# EAGLE design untitled (EAGLE 9.3.0)
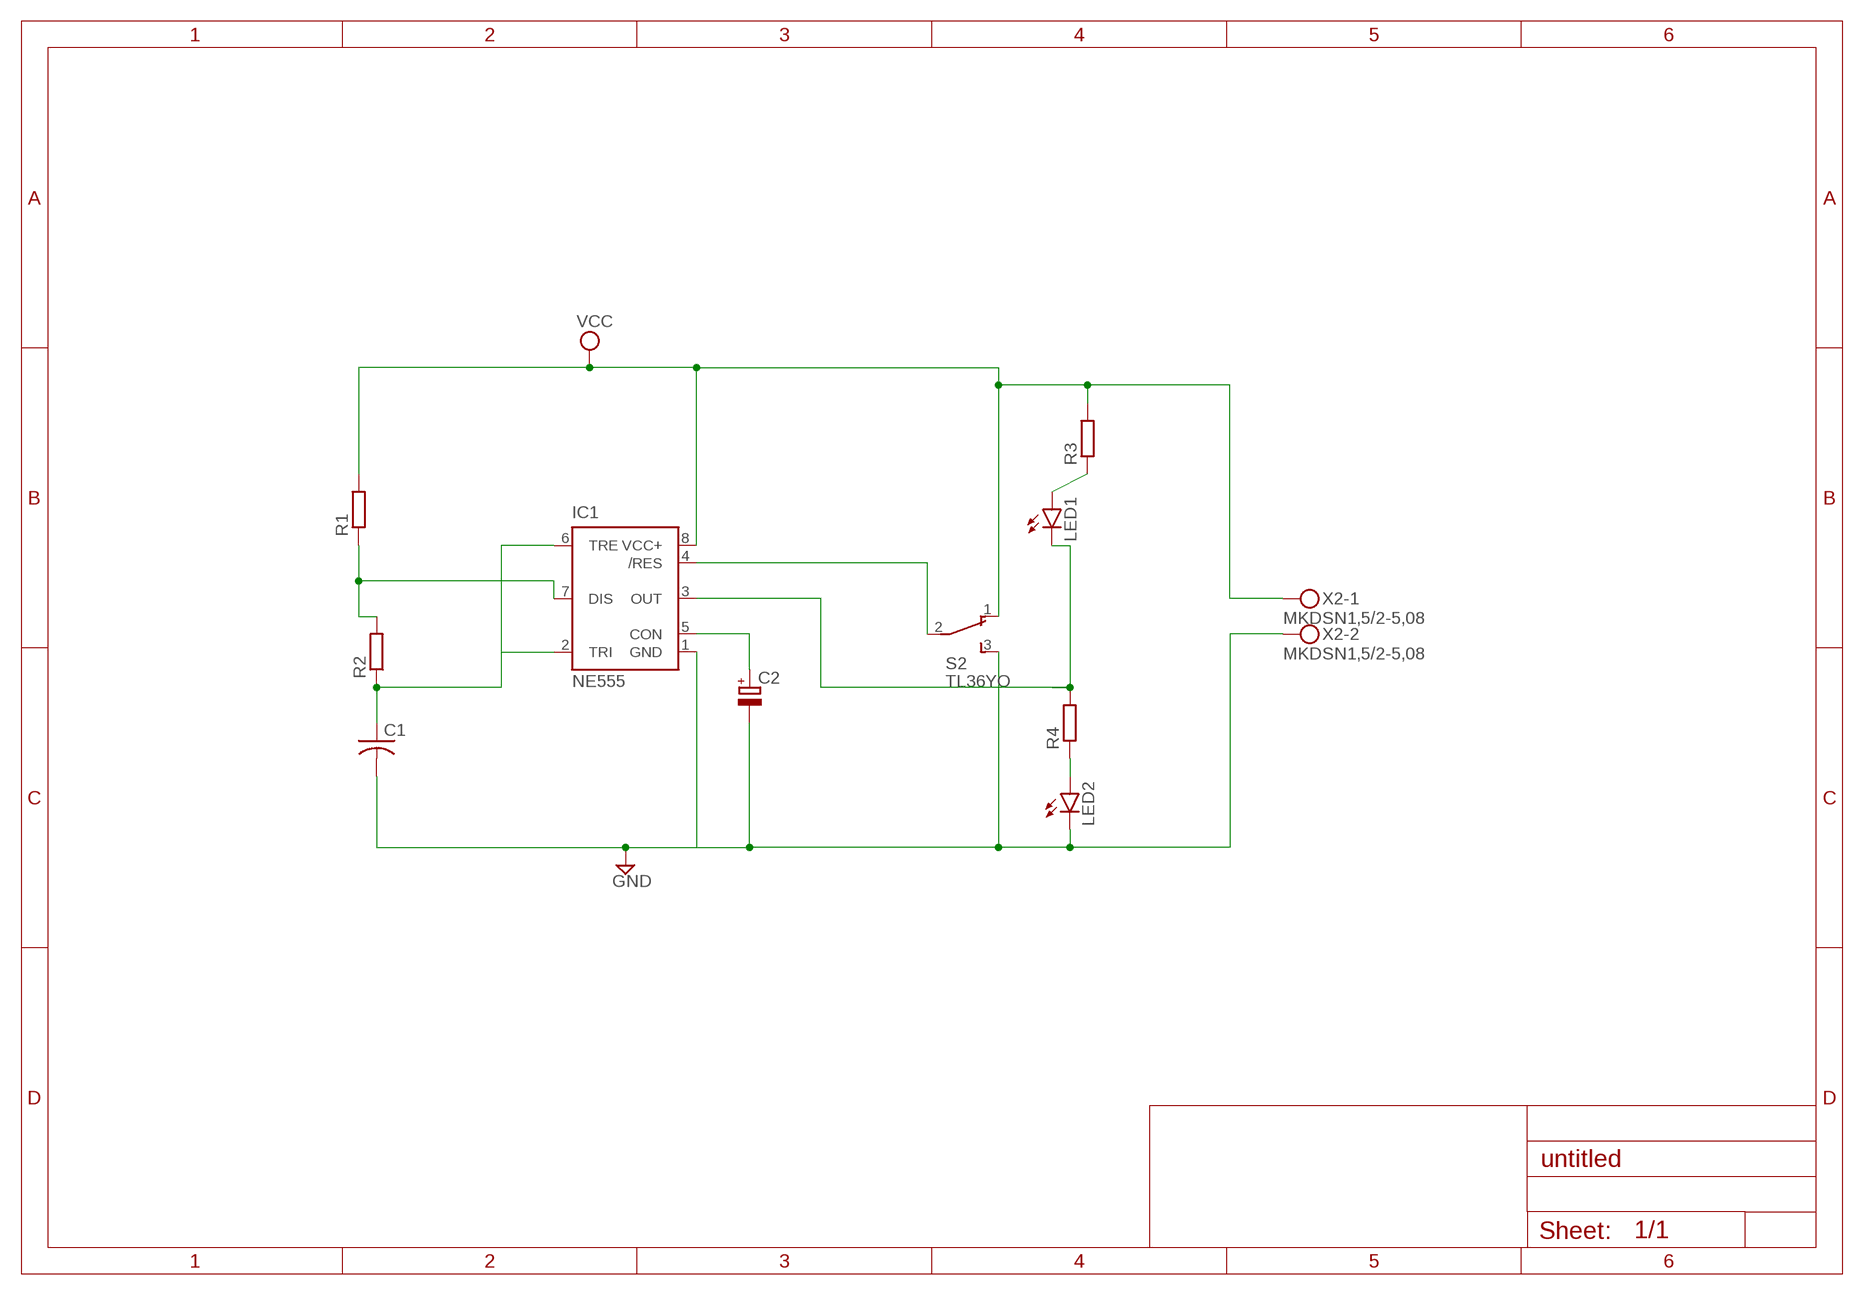
[diagram p0: schematic, sheet 1]

## Parts
C1  C-US025-025X050  [C025-025X050]
C2  CPOL-EUE3.5-8  [E3,5-8]
IC1  NE555  [DIL-08]
LED1  LED5MM  [LED5MM]
LED2  LED5MM  [LED5MM]
R1  R-EU_0309/12  [0309/12]
R2  R-EU_0309/12  [0309/12]
R3  R-EU_0309/12  [0309/12]
R4  R-EU_0309/12  [0309/12]
S2  TL36YO  [TL3XYO]
X2  MKDSN1,5/2-5,08  [MKDSN1,5/2-5,08]

## Nets
GND: C1.2 C2.- IC1.1(GND) LED2.K(C) S2.3(S) X2.2
N$1: IC1.7(DIS) R1.1 R2.2
N$2: C1.1 IC1.2(TRI) IC1.6(TRE) R2.1
N$3: C2.+ IC1.5(CON)
N$4: LED2.A R4.1
N$5: IC1.3(OUT) LED1.K(C) R4.2
N$6: IC1.4(/RES) S2.2(P)
N$7: LED1.A R3.1
VCC: IC1.8(VCC+) R1.2 R3.2 S2.1(O) X2.1

## Library data of the parts
C1 = rcl:C-US: CAPACITOR, American symbol; SPICEPREFIX: C
C2 = rcl:CPOL-EU: POLARIZED CAPACITOR, European symbol; SPICEPREFIX: C
IC1 = st-microelectronics:NE555: General purpose bipolar Timer; MF: Arrow Electronics; MPN: NE555N; OC_FARNELL: 1467742; OC_NEWARK: 89K1486
LED1 LED2 = led:LED: LED OSRAM: - CHIPLED LG R971, LG N971, LY N971, LG Q971, LY Q971, LO R971, LY R971 LH N974, LH R974 LS Q976, LO Q976, LY Q976 LO Q996 - Hyper CHIPLED LW Q18S LB Q993, LB Q99A, LB R99A - SideLED LS A670, LO A670, LY A670, LG A670, LP A670 LB A673, LV A673, LT A673, LW A673 LH A674 LY A675 LS A676, LA A676, LO A676, LY A676, LW A676 LS A679, LY A679, LG A679 - Hyper Micro SIDELED® LS Y876, LA Y876, LO Y876, LY Y876 LT Y87S - SmartLED LW L88C, LW L88S LB L89C, LB L89S, LG L890 LS L89K, LO L89K, LY L89K LS L896, LA L896, LO L896, LY L896 - TOPLED LS T670, LO T670, LY T670, LG T670, LP T670 LSG T670, LSP T670, LSY T670, LOP T670, LYG T670 LG T671, LOG T671, LSG T671 LB T673, LV T673, LT T673, LW T673 LH T674 LS T676, LA T676, LO T676, LY T676, LB T676, LH T676, LSB T676, LW T676 LB T67C, LV T67C, LT T67C, LS T67K, LO T67K, LY T67K, LW E67C LS E67B, LA E67B, LO E67B, LY E67B, LB E67C, LV E67C, LT E67C LW T67C LS T679, LY T679, LG T679 LS T770, LO T770, LY T770, LG T770, LP T770 LB T773, LV T773, LT T773, LW T773 LH T774 LS E675, LA E675, LY E675, LS T675 LS T776, LA T776, LO T776, LY T776, LB T776 LHGB T686 LT T68C, LB T68C - Hyper Mini TOPLED® LB M676 - Mini TOPLED Santana® LG M470 LS M47K, LO M47K, LY M47K Source: http://www.osram.convergy.de LUXEON: - LUMILED® LXK2-PW12-R00, LXK2-PW12-S00, LXK2-PW14-U00, LXK2-PW14-V00 LXK2-PM12-R00, LXK2-PM12-S00, LXK2-PM14-U00 LXK2-PE12-Q00, LXK2-PE12-R00, LXK2-PE12-S00, LXK2-PE14-T00, LXK2-PE14-U00 LXK2-PB12-K00, LXK2-PB12-L00, LXK2-PB12-M00, LXK2-PB14-N00, LXK2-PB14-P00, LXK2-PB14-Q00 LXK2-PR12-L00, LXK2-PR12-M00, LXK2-PR14-Q00, LXK2-PR14-R00 LXK2-PD12-Q00, LXK2-PD12-R00, LXK2-PD12-S00 LXK2-PH12-R00, LXK2-PH12-S00 LXK2-PL12-P00, LXK2-PL12-Q00, LXK2-PL12-R00 Source: www.luxeon.com KINGBRIGHT: KA-3528ASYC Source: www.kingbright.com
R1-R4 = rcl:R-EU_: RESISTOR, European symbol; SPICEPREFIX: R
S2 = switch:TL36YO: TINY SWITCH ON - ON Source: http://www2.produktinfo.conrad.com/datenblaetter/700000-724999/705152-da-01-de-Subminiaturschalter_TL_36YO.pdf
X2 = con-phoenix-508:MKDSN1,5/2-5,08: MKDSN 1,5/ 2-5,08 Printklemme Nennstrom: 13,5 A Nennspannung: 250 V Rastermaß: 5,08 mm Polzahl: 2 Anschlussart: Schraubanschluss Montage: Löten Anschlussrichtung Leiter/Platine: 0 ° Artikelnummer: 1729128 Source: http://eshop.phoenixcontact.com .. 1729128.pdf

## Board
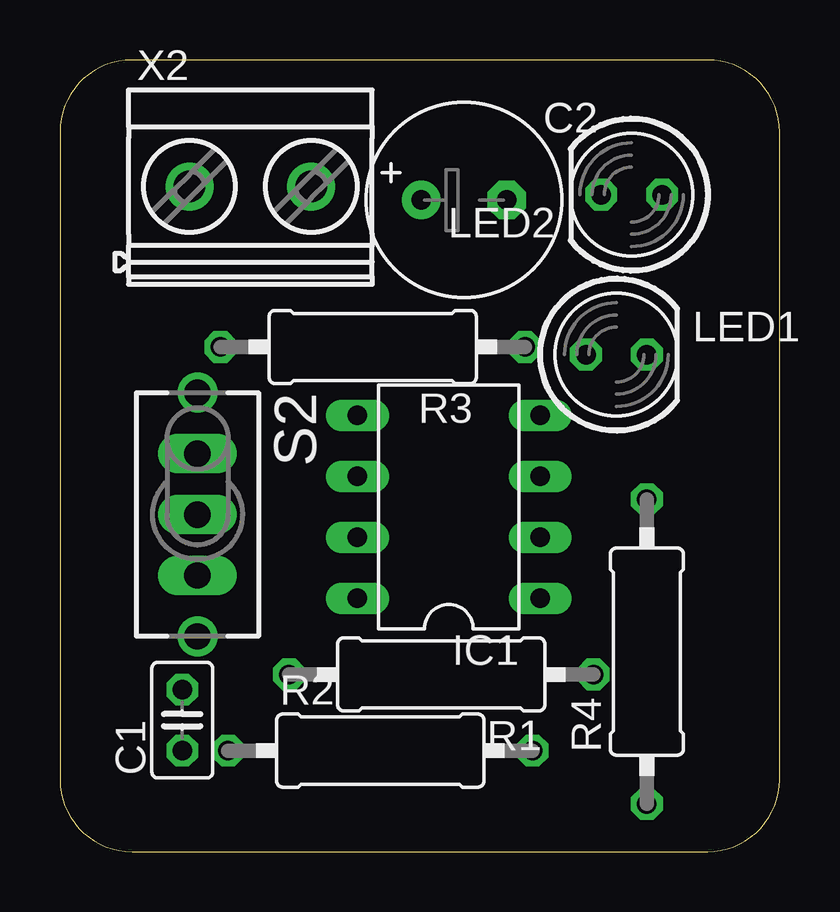
[diagram p1: board, top side]
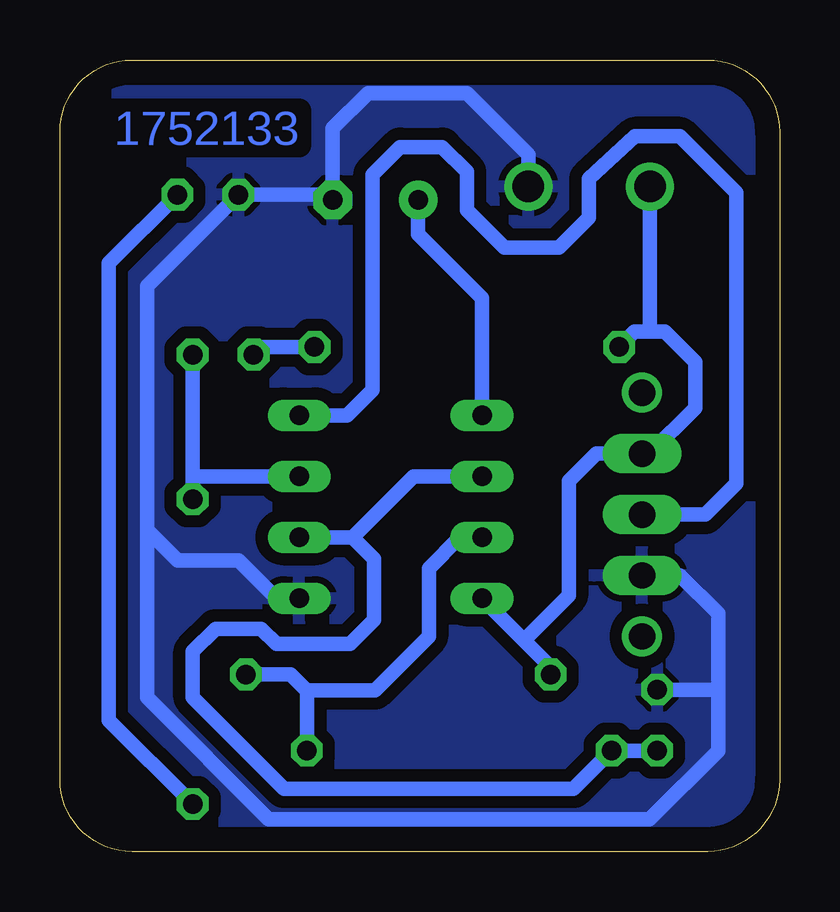
[diagram p2: board, bottom side, seen from below]

Size 30 x 33 mm. Coordinates in mm from the lower left corner, seen from the top.
Outline: 3,0 27,0 arc90 30,3 30,30 arc90 27,33 3,33 arc90 0,30 0,3 arc90 3,0
Copper layers (1*16): Top 0.035mm / dielectric 1.5mm / Bottom 0.035mm
Design rules "default": minimum track width 6mil, minimum drill 0.35mm, track to track 6mil, track to pad 6mil, pad to pad 6mil, via to via 6mil, smd to smd 6mil, copper to edge 40mil, drill to drill 6mil, minimum pad ring 10mil, minimum via ring 8mil, stop-mask expansion 4mil, vias tented up to drill 0mil, thermal gap 10mil

### Footprints (pad centres in the part's own frame; a part is rotated, then mirrored left to right if it is on the bottom)
C025-025X050 = drill 0.813 octagon: 1 -1.27,0; 2 1.27,0
E3,5-8 = drill 0.813 pad 1.6: + -1.778,0 | drill 0.813 pad 1.6 octagon: - 1.778,0
DIL-08 = drill 0.813 long: 1 -3.81,-3.81; 2 -1.27,-3.81; 3 1.27,-3.81; 4 3.81,-3.81; 5 3.81,3.81; 6 1.27,3.81; 7 -1.27,3.81; 8 -3.81,3.81
LED5MM = drill 0.813 octagon: A -1.27,0; K 1.27,0
0309/12 = drill 0.813 octagon: 1 -6.35,0; 2 6.35,0
TL3XYO = drill 1.1 pad 1.422 long: 1 -2.54,0; 2 0,0; 3 2.54,0 | drill 1.1 pad 1.676: M1 -5.08,0; M2 5.08,0
MKDSN1,5/2-5,08 = drill 1.3 pad 2: 1 -2.561,0.025; 2 2.519,0.025

### Placement (x,y rotation side)
C1  5.1,5.48 90 top
C2  16.85,27.16 0 top
IC1  16.21,14.37 90 top
LED1  23.2,20.72 0 top
LED2  23.83,27.38 180 top
R1  15.9,7.38 180 top
R2  13.35,4.21 0 top
R3  13.04,21.04 180 top
R4  24.47,8.34 90 top
S2  5.73,14.05 270 top
X2  7.96,27.7 0 top

### Tracks (layer width: path | path; a pad name or v marks a point on that pad's centre or on a via)
GND
  Bottom 0.61: X2.2 10.48,29.05 13.04,31.61 17.16,31.61 18.63,30.15 C2.- 18.85,27.38 LED2.K 26.37,23.57 26.37,13.41 | S2.3 4.15,11.51 2.56,9.92 2.56,6.75 | IC1.1 20.98,10.56 22.56,12.14 25.1,12.14 26.37,13.41 | 26.37,13.41 26.37,6.43 21.29,1.35 5.42,1.35 2.56,4.21 2.56,6.75 | C1.2 2.56,6.75
  pour Bottom (isolate 0.508): 3,0 27,0 arc90 30,3 30,30 arc90 27,33 3,33 arc90 0,30 0,3 arc90
N$1
  Bottom 0.61: 19.7,6.73 R2.2 | IC1.7 13.34,13.1 14.62,11.81 14.62,8.97 16.87,6.73 19.7,6.73 | R1.1 20.38,7.38 19.72,6.73 19.7,6.73
N$2
  Bottom 0.61: C1.1 R2.1 8.59,2.62 20.66,2.62 24.47,6.43 24.47,8.34 23.52,9.29 21.61,9.29 20.98,8.65 17.91,8.65 16.9,9.66 16.9,12.2 17.8,13.1 | 17.8,13.1 15.26,15.64 IC1.6 | IC1.2 17.8,13.1
N$3
  Bottom 0.61: C2.+ 15.07,25.75 12.4,23.08 IC1.5
N$4
  Bottom 0.61: R4.1 27.96,5.48 27.96,24.53 LED2.A
N$5
  Bottom 0.61: LED1.K 24.47,15.64 | 24.47,15.64 R4.2 | IC1.3 24.47,15.64
N$6
  Bottom 0.61: S2.2 3.1,14.05 1.8,15.35 1.8,27.46 4.16,29.82 6.03,29.82 7.96,28.05 7.96,26.43 9.21,25.18 11.47,25.18 13.04,26.75 13.04,28.34 14.07,29.37 15.81,29.37 16.96,28.22 16.96,19.24 18.02,18.18 IC1.4
N$7
  Bottom 0.61: LED1.A 21.61,21.04 R3.1
VCC
  Bottom 0.61: R3.2 6.05,21.67 5.42,21.67 | 5.42,21.67 4.78,21.67 3.51,20.4 3.51,18.5 5.42,16.59 S2.1 7.64,16.59 8.78,15.45 8.78,10.68 10.66,8.81 | IC1.8 10.66,8.81 | 10.66,8.81 9.55,7.7 R1.2 | X2.1 5.4,21.69 5.42,21.67

### Text on the board
Bottom: 1752133